# Altium schematic sheet power.SchDoc
size A3; SheetNumber: 2; SheetTotal: 6; SPICEModelCachePMSURHYN: <root> / <DocumentId>PMSURHYN</DocumentId> / <CacheFrame Number="0"> / <Model Name="bkp2125_hs600-t" Kind="CKT"> / <Text>* BKP2125_HS600-T     SPICE MODEL  ( General Type ) / *-------------------------------------------------------------------------------------------------------- / * Model Generated by TAIYO YUDEN Corporation (http://www.ty-top.com) / * Version 2.0 / * TAIYO YUDEN Control No. 070822 / * Copyright(c) 2007 TAIYO YUDEN CO.,LTD. All Rights Reserved. / *-------------------------------------------------------------------------------------------------------- / * / * Products Name : Ferrite Bead Inductors / * / * Characteristics : / *     Impedance at 100MHz : 60 Ohm , DC Resistance(max) : 0.025 Ohm , Rated Current : 3000 mA , / *     Case Size : 2.0 x 1.25 / 0.079 x 0.049 [mm/inch] , Thickness : 0.85 / 0.033 [mm/inch] / *     (Conditions: Temperature = 25 degC , DC Bias Current/Voltage = 0A / 0V) / * / * External Node Assignments : / * / *  1  o---GGG---o  2 / * / *-------------------------------------------------------------------------------------------------------- / .SubCkt BKP2125_HS600-T 1 2 / **************************** / R1 1 7 0.012 / R2 7 2 74 / C1 7 2 1.4p / L0 7 3 0.168u / L1 3 2 0.392u / L3 3 5 0.168u / R3 5 2 74 / **************************** / .ends BKP2125_HS600-T</Text> / </Model> / </CacheFrame> / </root>
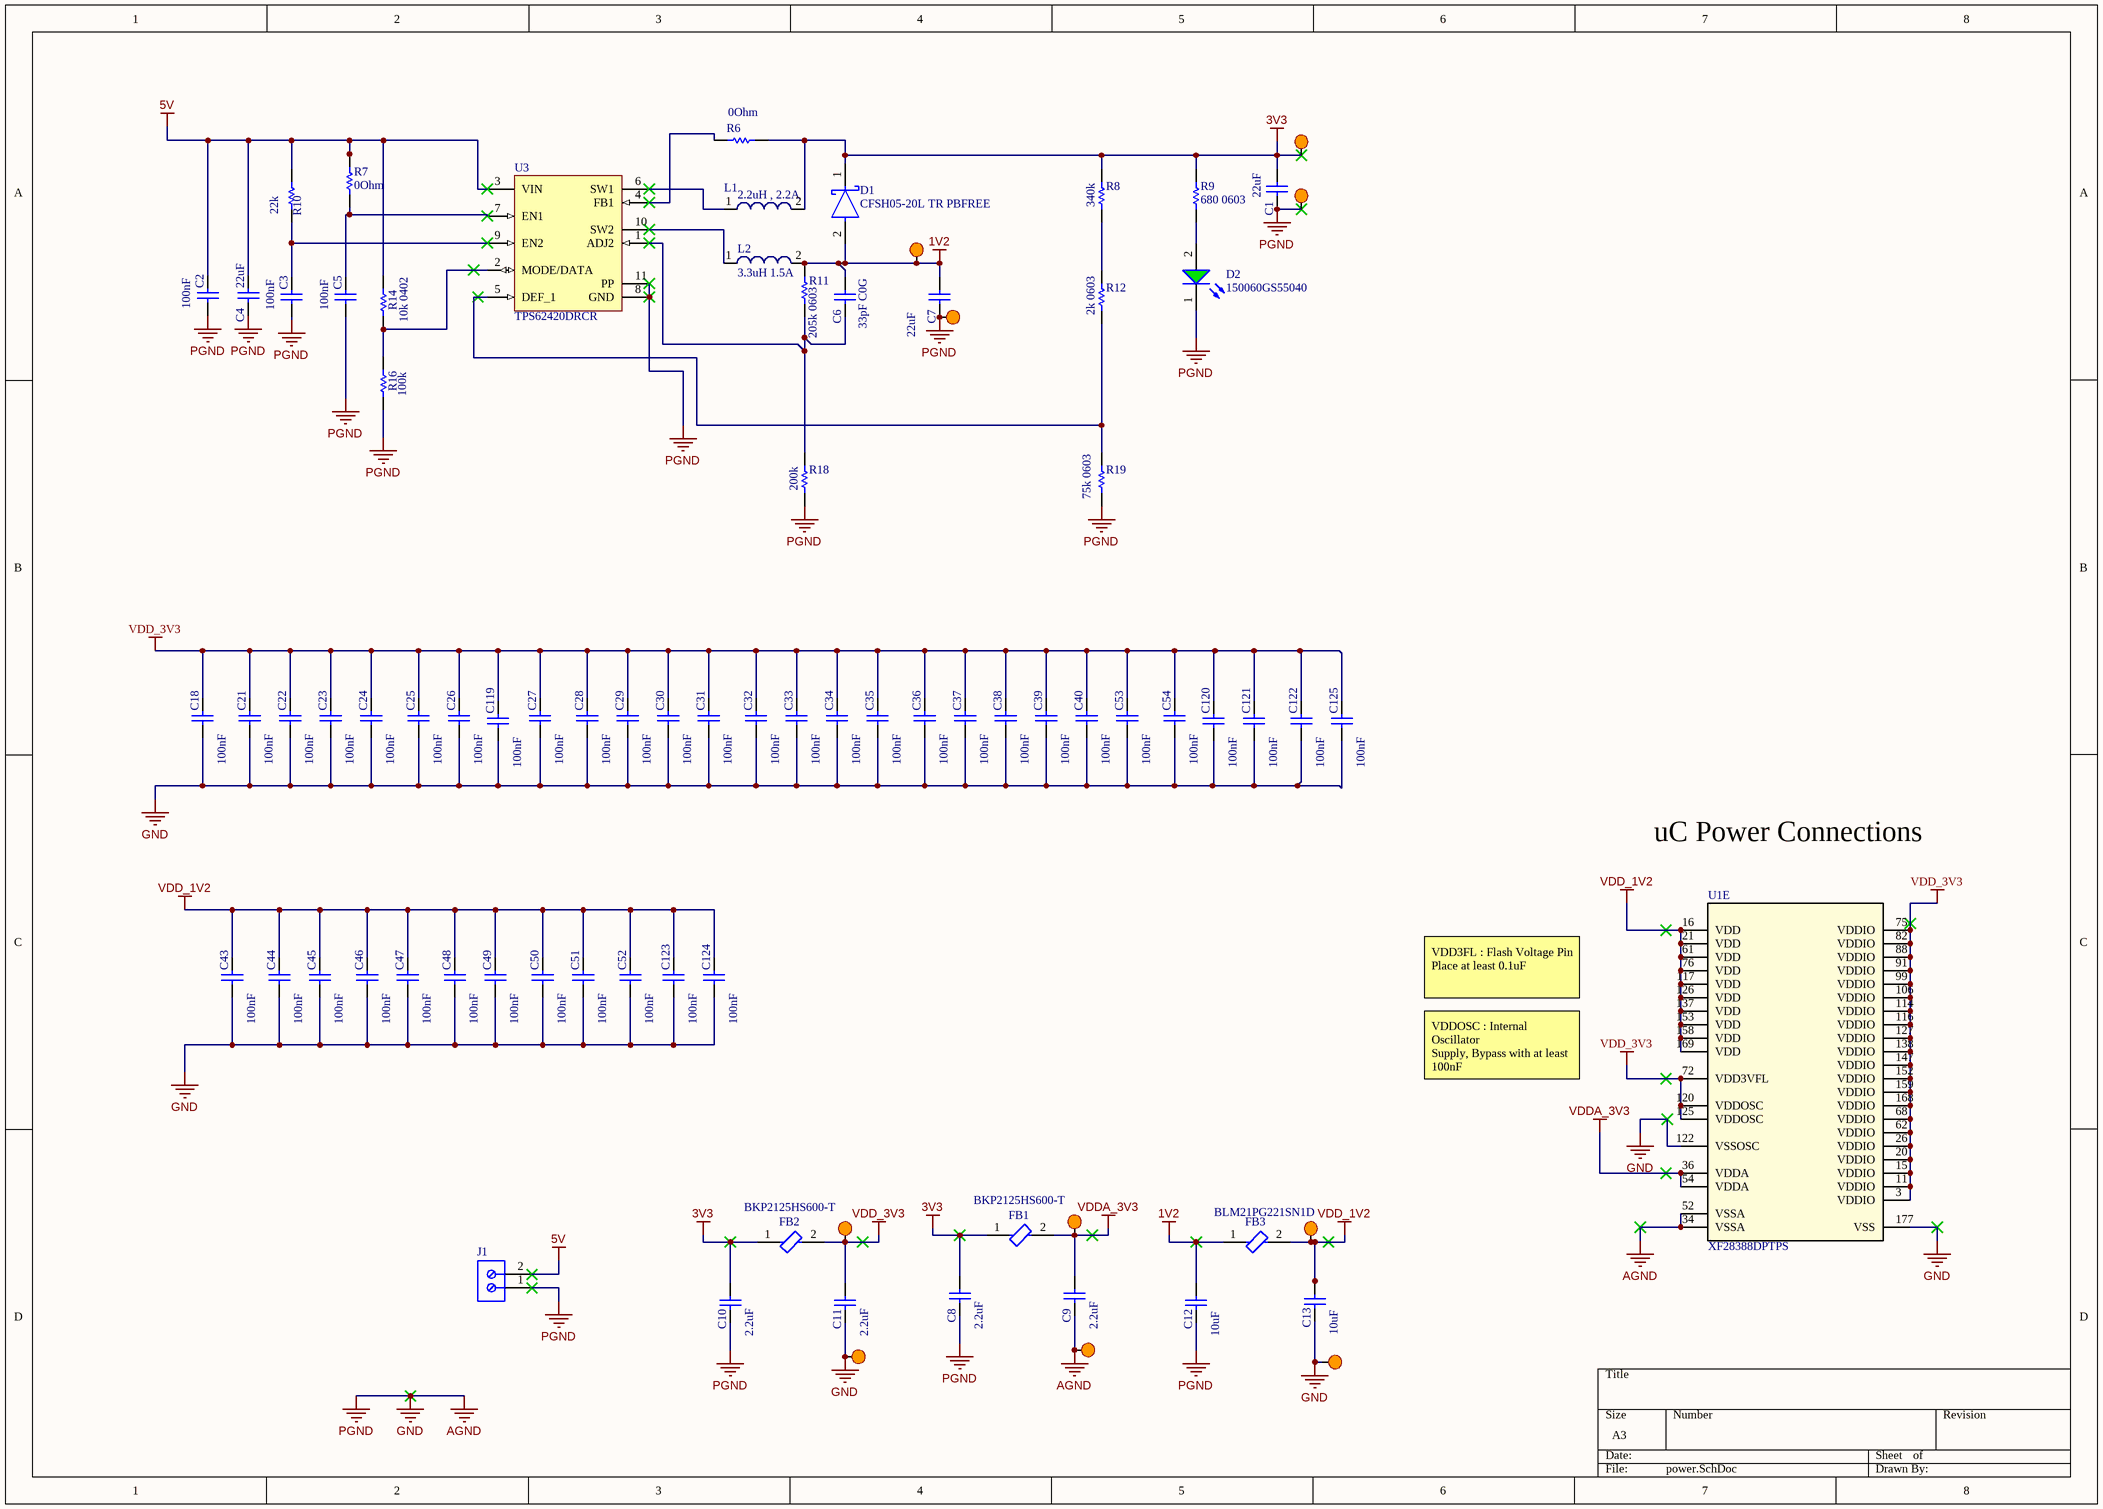
[diagram p0: power.SchDoc]

## Parts
C1  22uF  [CAP 0805_2012]
C2  100nF  [CAP 0402_1005]
C3  100nF  [CAP 0402_1005]
C4  22uF  [CAP 0805_2012]
C5  100nF  [CAP 0402_1005]
C6  33pF C0G  [CAP 0603_1608]
C7  22uF  [CAP 0805_2012]
C8  2.2uF  [CAP 0603_1608]
C9  2.2uF  [CAP 0603_1608]
C10  2.2uF  [CAP 0603_1608]
C11  2.2uF  [CAP 0603_1608]
C12  10uF  [CAP 0805_2012]
C13  10uF  [CAP 0805_2012]
C18  100nF  [CAP 0402_1005]
C21  100nF  [CAP 0402_1005]
C22  100nF  [CAP 0402_1005]
C23  100nF  [CAP 0402_1005]
C24  100nF  [CAP 0402_1005]
C25  100nF  [CAP 0402_1005]
C26  100nF  [CAP 0402_1005]
C27  100nF  [CAP 0402_1005]
C28  100nF  [CAP 0402_1005]
C29  100nF  [CAP 0402_1005]
C30  100nF  [CAP 0402_1005]
C31  100nF  [CAP 0402_1005]
C32  100nF  [CAP 0402_1005]
C33  100nF  [CAP 0402_1005]
C34  100nF  [CAP 0402_1005]
C35  100nF  [CAP 0402_1005]
C36  100nF  [CAP 0402_1005]
C37  100nF  [CAP 0402_1005]
C38  100nF  [CAP 0402_1005]
C39  100nF  [CAP 0402_1005]
C40  100nF  [CAP 0402_1005]
C43  100nF  [CAP 0402_1005]
C44  100nF  [CAP 0402_1005]
C45  100nF  [CAP 0402_1005]
C46  100nF  [CAP 0402_1005]
C47  100nF  [CAP 0402_1005]
C48  100nF  [CAP 0402_1005]
C49  100nF  [CAP 0402_1005]
C50  100nF  [CAP 0402_1005]
C51  100nF  [CAP 0402_1005]
C52  100nF  [CAP 0402_1005]
C53  100nF  [CAP 0402_1005]
C54  100nF  [CAP 0402_1005]
C119  100nF  [CAP 0402_1005]
C120  100nF  [CAP 0402_1005]
C121  100nF  [CAP 0402_1005]
C122  100nF  [CAP 0402_1005]
C123  100nF  [CAP 0402_1005]
C124  100nF  [CAP 0402_1005]
C125  100nF  [CAP 0402_1005]
D1  CFSH05-20L TR PBFREE  [FP-SOD-882L-MFG]
D2  150060GS55040  [WL-SMCD_0603]
FB1  BKP2125HS600-T  [FP-BKP2125-MFG]
FB2  BKP2125HS600-T  [FP-BKP2125-MFG]
FB3  BLM21PG221SN1D  [FP-BLM21-0_2-t0_85-e0_5-IPC_B]
J1  691709710302  [691709710302]  (value not drawn)
L1  2.2uH , 2.2A  [WE-LQS 4018]
L2  3.3uH 1.5A  [WE-LQS 3015]
R6  0Ohm  [RES 0603_1608]
R7  0Ohm  [RES 0603_1608]
R8  340k  [RES 0603_1608]
R9  680 0603  [RES 0603_1608]
R10  22k  [RES 0603_1608]
R11  205k 0603  [RES 0603_1608]
R12  2k 0603  [RES 0603_1608]
R14  10k 0402  [RES 0402_1005]
R16  100k  [RES 0402_1005]
R18  200k  [RES 0603_1608]
R19  75k 0603  [RES 0603_1608]
TP1  TP?  [testpoint]  (value not drawn)
TP2  TP?  [testpoint]  (value not drawn)
TP3  TP?  [testpoint]  (value not drawn)
TP4  TP?  [testpoint]  (value not drawn)
TP8  TP?  [testpoint]  (value not drawn)
TP9  TP?  [testpoint]  (value not drawn)
TP10  TP?  [testpoint]  (value not drawn)
TP11  TP?  [testpoint]  (value not drawn)
TP12  TP?  [testpoint]  (value not drawn)
TP13  TP?  [testpoint]  (value not drawn)
U1  XF28388DPTPS  [PTP0176F-IPC_A]  (part E of 5)
U3  TPS62420DRCR  [DRC0010J_V]

## Nets
1V2: C6.2 C7.2 C12.2 D1.2(A) FB3.1 L2.2 R11.2 TP4.1
3V3: C1.2 C8.2 C10.2 D1.1(C) FB1.1 FB2.1 L1.2 R6.2 R8.2 R9.2 TP1.1
5V: C2.2 C4.2 J1.2 R7.1 R10.2 R14.2 U3.3(VIN)
AGND: C1.1 C2.1 C3.1 C4.1 C5.1 C7.1 C8.1 C9.1 C10.1 C11.1 C12.1 C13.1 C18.1 C21.1 C22.1 C23.1 C24.1 C25.1 C26.1 C27.1 C28.1 C29.1 C30.1 C31.1 C32.1 C33.1 C34.1 C35.1 C36.1 C37.1 C38.1 C39.1 C40.1 C43.1 C44.1 C45.1 C46.1 C47.1 C48.1 C49.1 C50.1 C51.1 C52.1 C53.1 C54.1 C119.1 C120.1 C121.1 C122.1 C123.1 C124.1 C125.1 D2.1(K) J1.1 R16.1 R18.1 R19.1 TP2.1 TP3.1 TP11.1 TP12.1 TP13.1 U1.34(VSSA) U1.52(VSSA) U1.122(VSSOSC) U1.177(VSS) U3.8(GND) U3.11(PP)  [also labelled GND, PGND]
VDD_1V2: C13.2 C43.2 C44.2 C45.2 C46.2 C47.2 C48.2 C49.2 C50.2 C51.2 C52.2 C123.2 C124.2 FB3.2 TP10.1 U1.16(VDD) U1.21(VDD) U1.61(VDD) U1.76(VDD) U1.117(VDD) U1.126(VDD) U1.137(VDD) U1.153(VDD) U1.158(VDD) U1.169(VDD)
VDD_3V3: C11.2 C18.2 C21.2 C22.2 C23.2 C24.2 C25.2 C26.2 C27.2 C28.2 C29.2 C30.2 C31.2 C32.2 C33.2 C34.2 C35.2 C36.2 C37.2 C38.2 C39.2 C40.2 C53.2 C54.2 C119.2 C120.2 C121.2 C122.2 C125.2 FB2.2 TP9.1 U1.3(VDDIO) U1.11(VDDIO) U1.15(VDDIO) U1.20(VDDIO) U1.26(VDDIO) U1.62(VDDIO) U1.68(VDDIO) U1.72(VDD3VFL) U1.75(VDDIO) U1.82(VDDIO) U1.88(VDDIO) U1.91(VDDIO) U1.99(VDDIO) U1.106(VDDIO) U1.114(VDDIO) U1.116(VDDIO) U1.120(VDDOSC) U1.125(VDDOSC) U1.127(VDDIO) U1.138(VDDIO) U1.147(VDDIO) U1.152(VDDIO) U1.159(VDDIO) U1.168(VDDIO)
VDDA_3V3: C9.2 FB1.2 TP8.1 U1.36(VDDA) U1.54(VDDA)
NetC3_2: C3.2 R10.1 U3.9(EN2)
NetC5_2: C5.2 R7.2 U3.7(EN1)
NetC6_1: C6.1 R11.1 R18.2 U3.1(ADJ2)
NetD2_2: D2.2(A) R9.1
NetL1_1: L1.1 U3.6(SW1)
NetL2_1: L2.1 U3.10(SW2)
NetR6_1: R6.1 U3.4(FB1)
NetR8_1: R8.1 R12.2
NetR12_1: R12.1 R19.2 U3.5(DEF_1)
NetR14_1: R14.1 R16.2 U3.2(MODE/DATA)

## Notes on the sheet
- uC Power Connections
- VDD3FL : Flash Voltage Pin
  Place at least 0.1uF
- VDDOSC : Internal Oscillator
  Supply, Bypass with at least 100nF

## Library data of the parts
C1 C4 C7 = Cap: MLCC 22uF 0805 5V; Published: 8-Jun-2000; LatestRevisionDate: 17-Jul-2002; LatestRevisionNote: Re-released for DXP Platform.; PackageReference: RAD-0.3; Publisher: Altium Limited; PackageDescription: Radial Cap, Thru-Hole; 2 Leads; 0.3 in Pin Spacing; Value: 22uF
C2 C3 C5 C18 C21-C40 C43-C54 C119-C125 = Cap: MLCC 100nF 0402 10V; Published: 8-Jun-2000; LatestRevisionDate: 17-Jul-2002; LatestRevisionNote: Re-released for DXP Platform.; PackageReference: RAD-0.3; Publisher: Altium Limited; PackageDescription: Radial Cap, Thru-Hole; 2 Leads; 0.3 in Pin Spacing; Value: 100nF; Supplier 1: Arrow Electronics; Supplier Part Number 1: C0402C104K8PACTU
C6 = Cap: MLCC 33pF 0603 10V C0G; Published: 8-Jun-2000; LatestRevisionDate: 17-Jul-2002; LatestRevisionNote: Re-released for DXP Platform.; PackageReference: RAD-0.3; Publisher: Altium Limited; PackageDescription: Radial Cap, Thru-Hole; 2 Leads; 0.3 in Pin Spacing; Value: 33pF
C8-C11 = Cap: MLCC 2.2uF 0603 10V; Published: 8-Jun-2000; LatestRevisionDate: 17-Jul-2002; LatestRevisionNote: Re-released for DXP Platform.; PackageReference: RAD-0.3; Publisher: Altium Limited; PackageDescription: Radial Cap, Thru-Hole; 2 Leads; 0.3 in Pin Spacing; Value: 2.2uF
C12 C13 = Cap: MLCC 10uF 0805 10V; Published: 8-Jun-2000; LatestRevisionDate: 17-Jul-2002; LatestRevisionNote: Re-released for DXP Platform.; PackageReference: RAD-0.3; Publisher: Altium Limited; PackageDescription: Radial Cap, Thru-Hole; 2 Leads; 0.3 in Pin Spacing; Value: 10uF; Supplier 1: Mouser; Supplier Part Number 1: 80-C0805C106K8P
D1 = CMP-00647-58683154-1: CFSH05-20L TR PBFREE Rectifier Diode, Schottky, 1 Phase, 1 Element, 0.1A, 30V V(RRM); Schedule B: 8541100070, 8541100070; NexarPartId: 58683154; RoHS: Non-Compliant
D2 = CMP-03913-90235563-2: 150060GS55040 WL-SMCD SMT Mono-color Chip LED Diffused; Forward Voltage: 3.2V; Forward Current: 60mA; Luminous Intensity: 430mcd; Peak Wavelength: 520nm; Viewing Angle: 140°; Wavelength: 525nm; Max Reverse Voltage (DC): 5V; Max Operating Temperature: 85°C; Length: 1.6mm; Height: 400µm; Packaging: Tape and Reel; NexarPartId: 90235563; Dominant Wavelength: 525nm; Min Operating Temperature: -40°C; RoHS: Compliant; Width: 800µm
FB1 FB2 = CMP-14488-000008-2: None; Max DC Current: 3A; Tolerance: 25%; Number of Lines: 1; DC Resistance (DCR): 25mR; Core Material: Ferrite; Impedance: 60R; Test Frequency: 100MHz; Shielding: Unshielded; Packaging: Tape and Reel; Case Code (Imperial): 0805; Series: BK; Package Quantity: 1; Lead Free: Lead Free; Number of Pins: 2; Max Current Rating: 3A; Length: 2.3mm; Case/Package: 0805; Max Operating Temperature: 85°C; Min Operating Temperature: -55°C; Case Code (Metric): 2125; Depth: 1.45mm; Resistance: 25mR; Halogen Free: Halogen Free; Termination: SMD/SMT; Width: 0.049inch; RoHS Compliant: Yes; Mount: Surface Mount; Height: 1.05mm
FB3 = CMP-0686-00610-3: Chip Ferrite Bead, 0805, 220Ω @ 100MHz, 0.045Ω, 25%, 2A; Number of Circuits: 1; Shielding: Unshielded; DC Resistance (DCR): 45mR; Impedance: 220R; Radiation Hardening: No; Material: Ferrite; Frequency: 100MHz; Width: 1.25mm; DC Current: 2A; Max DC Current: 2A; Number of Lines: 1; Package Quantity: 1; Case Code (Metric): 2012; Current Rating: 2A; Case/Package: 0805; Current: 2A; Military Standard: Not; Core Material: Ferrite; Depth: 1.25mm; Contact Plating: Tin; DC Resistance-Max: 45mR; Max Operating Temperature: 125°C; Length: 2mm; Max Current Rating: 2A; REACH SVHC: No SVHC; Termination: SMD/SMT; Min Operating Temperature: -55°C; Series: BLM21P; Test Frequency: 100MHz; Tolerance: 25%; Number of Pins: 2; RoHS Compliant: Yes; Height: 0.85mm; Packaging: Tape and Reel; Lead Free: Lead Free; Case Code (Imperial): 0805
J1 = CMP-1502-03335-2: SMD Terminal Block 6A; NexarPartId: 34186867; Number of Positions: 2; Number of Levels: 1; Pitch: 5mm; Wire Gauge (Min): 14AWG; Wire Gauge (Max): 30AWG; Connector Type: Screw; Voltage: 300V; Plating: Steel; Housing Material: Nylon; Lead Pitch: 5mm; Current Rating: 6A; REACH SVHC: Unknown; Flammability Rating: UL94 V-0; Height: 11.1mm; Termination: Screw; Current: 6A; Contact Plating: Tin; Number of Rows: 1; Max Operating Temperature: 130°C; Color: Black; Mount: Surface Mount; Voltage Rating: 300V; Min Operating Temperature: -40°C; Contact Material: Tin; Wire/Cable Gauge: 30AWG; Packaging: Digi-Reel®; Length: 10mm; Number of Pins: 2; RoHS: Compliant; Number of Contacts: 2; Number of Positions Per Level: 2; Supplier 1: Digikey; Supplier Part Number 1: 1297-1108-1-ND
L1 = CMP-1354-00032-1: WE-LQS SMD Power Inductor, L=2.2 µH; PartNumber: 74404042022; Manufacturer: Wuerth Elektronik; Inductance: 2.2 ÂµH; ComponentLink1Description: Manufacturer URL; PackageReference: WE-LQS 4018; ComponentLink2URL: http://katalog.we-online.de/pbs/datasheet/74404042022.pdf; ComponentLink2Description: Datasheet; ComponentLink1URL: http://www.we-online.com
L2 = CMP-1354-00021-1: WE-LQS SMD Power Inductor, L=3.3 µH; PartNumber: 74404032033; Manufacturer: Wuerth Elektronik; Inductance: 3.3 ÂµH; ComponentLink2Description: Datasheet; ComponentLink2URL: http://katalog.we-online.de/pbs/datasheet/74404032033.pdf; ComponentLink1Description: Manufacturer URL; ComponentLink1URL: http://www.we-online.com; PackageReference: WE-LQS 3015
R6 R7 = Res1: Resistor 0Ohm 0603; Value: 22k; Published: 8-Jun-2000; LatestRevisionDate: 17-Jul-2002; LatestRevisionNote: Re-released for DXP Platform.; PackageReference: AXIAL-0.3; Publisher: Altium Limited; PackageDescription: Axial Device, Thru-Hole; 2 Leads; 0.3 in Pin Spacing; Supplier 1: Future Electronics; Supplier Part Number 1: 3375797
R8 = Res1: Resistor 340kOhm 0603; Published: 8-Jun-2000; LatestRevisionDate: 17-Jul-2002; LatestRevisionNote: Re-released for DXP Platform.; PackageReference: AXIAL-0.3; Publisher: Altium Limited; PackageDescription: Axial Device, Thru-Hole; 2 Leads; 0.3 in Pin Spacing; Value: 340k; Supplier 1: Digikey; Supplier Part Number 1: 1712-CPF0603B340KE1CT-ND
R9 = Res1: Resistor 680Ohm 0603; Value: 680; Published: 8-Jun-2000; LatestRevisionDate: 17-Jul-2002; LatestRevisionNote: Re-released for DXP Platform.; PackageReference: AXIAL-0.3; Publisher: Altium Limited; PackageDescription: Axial Device, Thru-Hole; 2 Leads; 0.3 in Pin Spacing
R10 = Res1: Resistor 22kOhm 0603; Published: 8-Jun-2000; LatestRevisionDate: 17-Jul-2002; LatestRevisionNote: Re-released for DXP Platform.; PackageReference: AXIAL-0.3; Publisher: Altium Limited; PackageDescription: Axial Device, Thru-Hole; 2 Leads; 0.3 in Pin Spacing; Value: 22k; Supplier 1: Future Electronics; Supplier Part Number 1: 1933787
R11 = Res1: Resistor 205kOhm 0603; Published: 8-Jun-2000; LatestRevisionDate: 17-Jul-2002; LatestRevisionNote: Re-released for DXP Platform.; PackageReference: AXIAL-0.3; Publisher: Altium Limited; PackageDescription: Axial Device, Thru-Hole; 2 Leads; 0.3 in Pin Spacing; Value: 205k
R12 = Res1: Resistor 2kOhm 0603; Published: 8-Jun-2000; LatestRevisionDate: 17-Jul-2002; LatestRevisionNote: Re-released for DXP Platform.; PackageReference: AXIAL-0.3; Publisher: Altium Limited; PackageDescription: Axial Device, Thru-Hole; 2 Leads; 0.3 in Pin Spacing; Value: 2k
R14 = Res1: Resistor 10kOhm 0402; Published: 8-Jun-2000; LatestRevisionDate: 17-Jul-2002; LatestRevisionNote: Re-released for DXP Platform.; PackageReference: AXIAL-0.3; Publisher: Altium Limited; PackageDescription: Axial Device, Thru-Hole; 2 Leads; 0.3 in Pin Spacing; Value: 10k
R16 = Res1: Resistor 100kOhm 0402; Value: 10k; Published: 8-Jun-2000; LatestRevisionDate: 17-Jul-2002; LatestRevisionNote: Re-released for DXP Platform.; PackageReference: AXIAL-0.3; Publisher: Altium Limited; PackageDescription: Axial Device, Thru-Hole; 2 Leads; 0.3 in Pin Spacing
R18 = Res1: Resistor 200kOhm 0603; Published: 8-Jun-2000; LatestRevisionDate: 17-Jul-2002; LatestRevisionNote: Re-released for DXP Platform.; PackageReference: AXIAL-0.3; Publisher: Altium Limited; PackageDescription: Axial Device, Thru-Hole; 2 Leads; 0.3 in Pin Spacing; Value: 200k; Supplier: Arrow Electronics; Supplier Part Number: GRM155R71C104KA88D
R19 = Res1: Resistor 75kOhm 0603; Published: 8-Jun-2000; LatestRevisionDate: 17-Jul-2002; LatestRevisionNote: Re-released for DXP Platform.; PackageReference: AXIAL-0.3; Publisher: Altium Limited; PackageDescription: Axial Device, Thru-Hole; 2 Leads; 0.3 in Pin Spacing; Value: 75k
TP1-TP4 TP8-TP13 = testpoint
U1 = XF28388DPTPS: Mfr_Name: Texas Instruments; TYPE: TYPE; RefDes: RefDes
U3 = CMP-0323-00293-3: Buck Adjustable Regulator with 2.5 to 6 V Input and 0.6 to 6 V Output, -40 to 85 degC, 10-Pin SON (DRC), Green (RoHS & no Sb/Br); Manufacturer: Texas Instruments; Iout2(Max)(A): 1; Vout(Min)(V): 0.6; Vin(Min)(V): 2.5; SubFamily: Step-Down Regulator; Regulated Outputs(#): 2; Dynamic Voltage Scaling: TRUE; Iq(Typ)(mA): 0.032; Vout(Max)(V): 6; Rating: Catalog; Duty Cycle(Max)(%): 100; ComponentLink2URL: http://www.ti.com/litv/pdf/mpds117k; ComponentLink1URL: http://www.ti.com/general/docs/lit/getliterature.tsp?genericPartNumber=TPS62420&fileType=pdf; Switch Current Limit(Typ)(A): 1; PartNumber: TPS62420DRCR; ComponentLink2Description: Package Specification; Topology: Buck; Mounting Technology: Surface Mount; PackageVersion: revL, Sep-2011; ComponentLink1Description: Datasheet; Iout(Max)(A): 0.6; PackageDescription: 10-Pin Plastic Small Outline No-Lead, 3 x 3 x 1 mm Body, 0.5 mm Pitch, Exposed Pad; ComponentLink3URL: Samples URL:http://www.ti.com/product/tps62420#samples; Eco-Plan: Green (RoHS & no Sb/Br); ComponentLink3Description: URL Link1; PackageReference: DRC0010J; Vout2(Max)(V): 6; DatasheetVersion: SLVS676C; Synchronous Rectification: TRUE; Vin(Max)(V): 6; Vout2(Min)(V): 0.6